# EAGLE design mixer_board_smd_full (EAGLE 9.4.0)
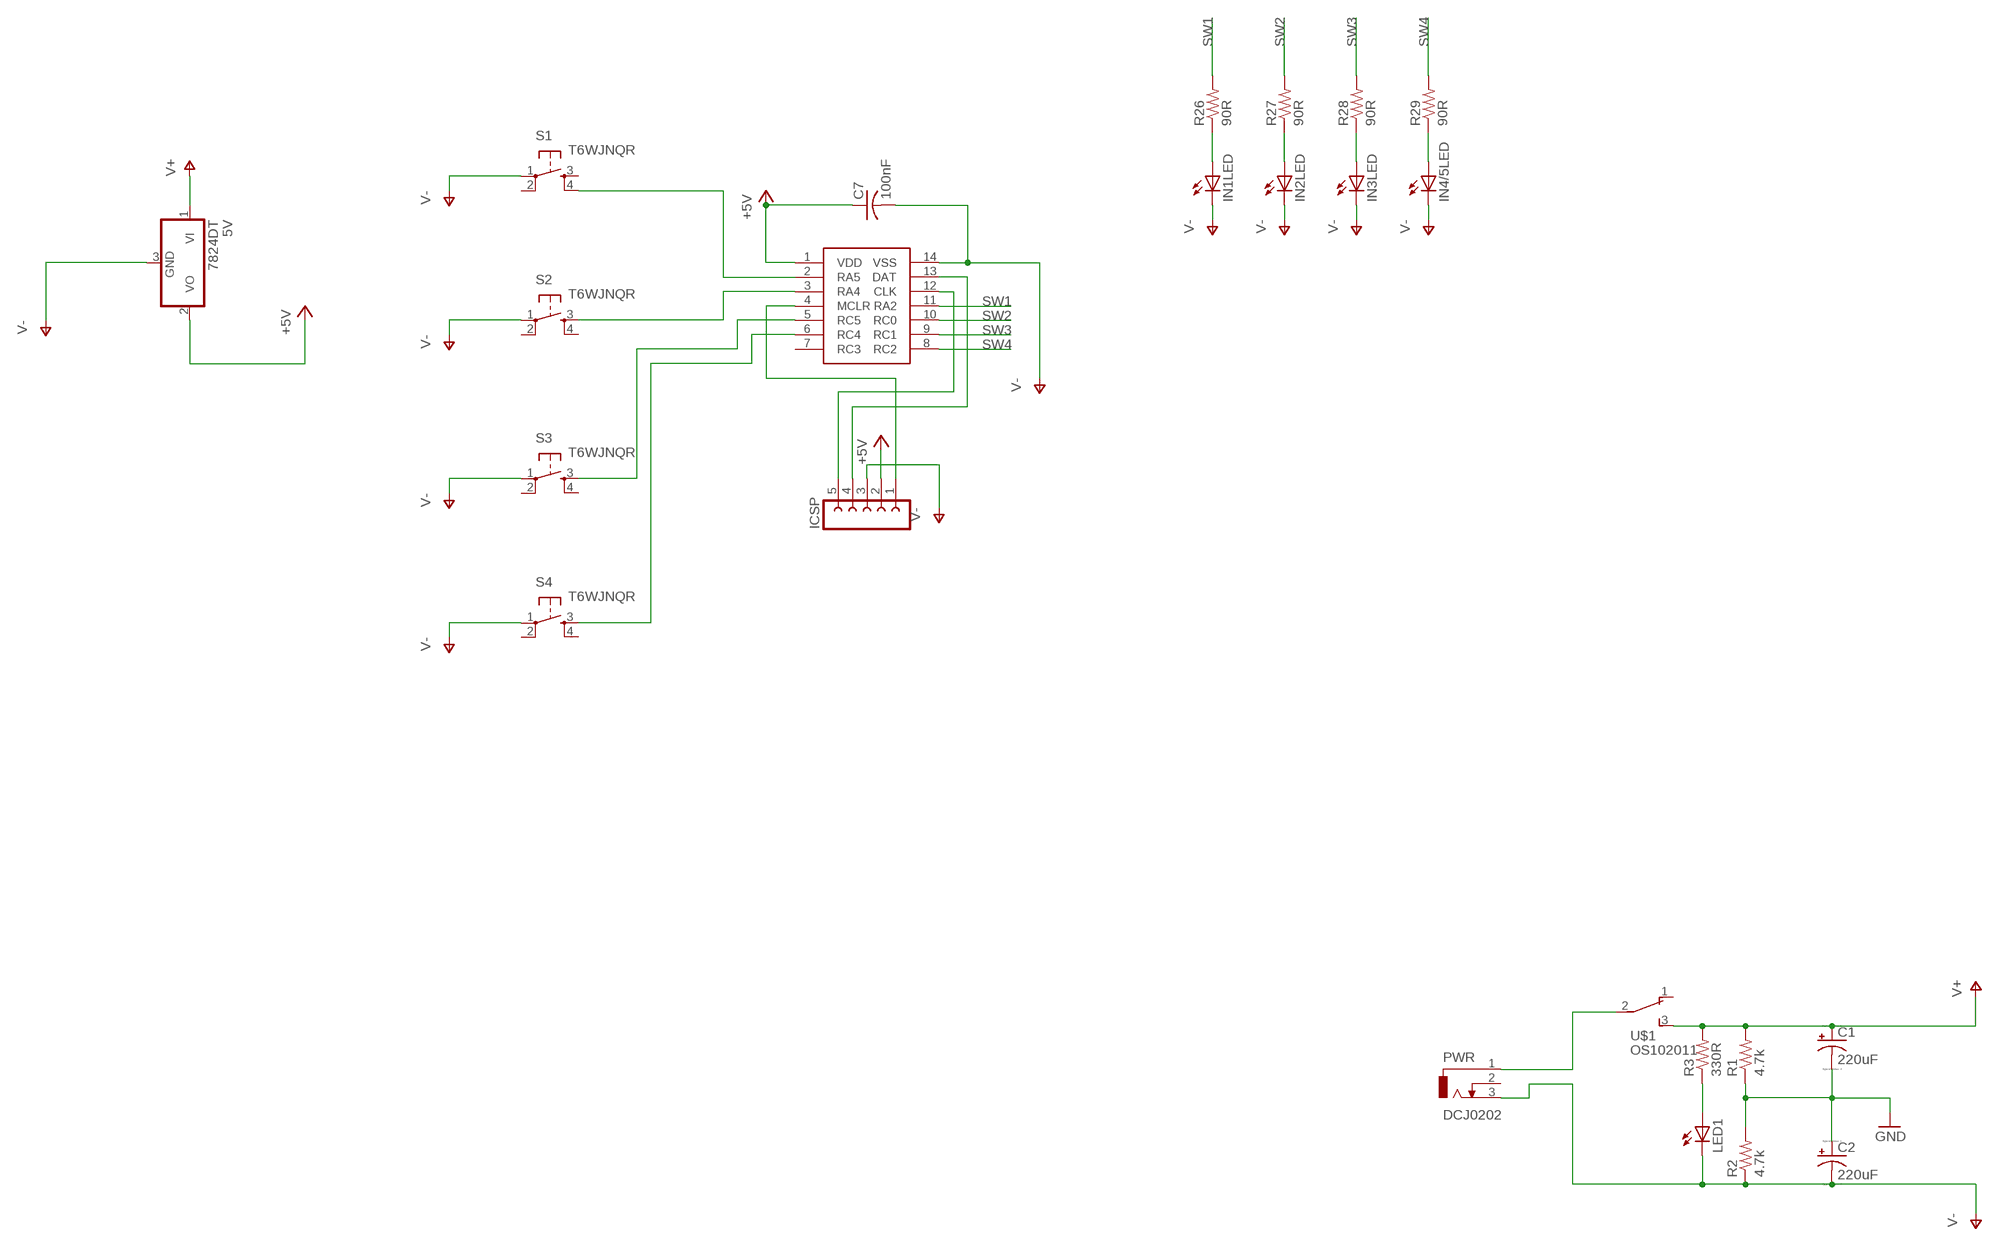
[diagram p0: schematic, sheet 1, part 1 of 2]
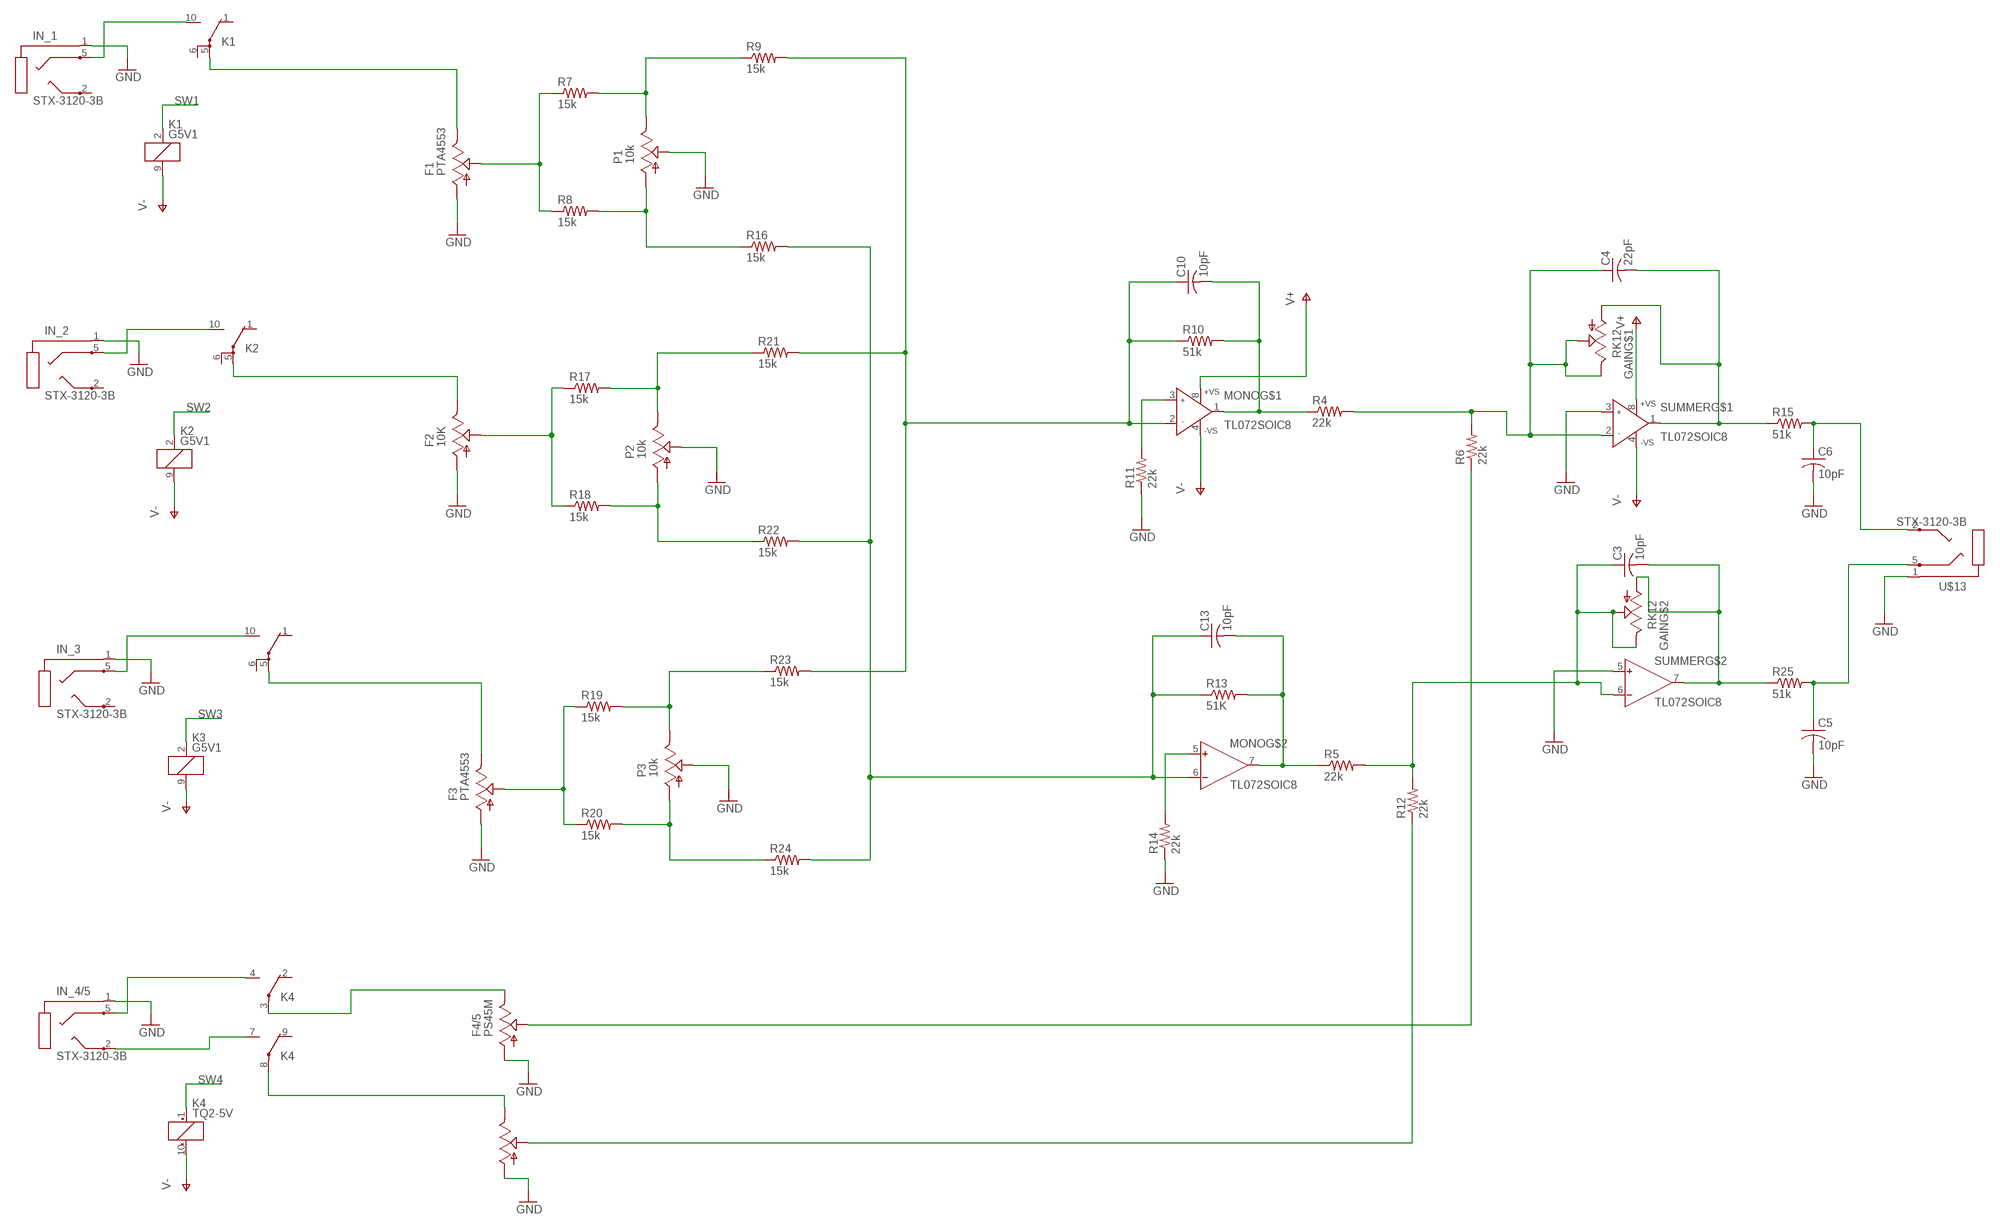
[diagram p1: schematic, sheet 1, part 2 of 2]

## Parts
5V  7824DT  [TO252]
C1  220uF  CPOL-USE1.8-4  [E1,8-4]
C2  220uF  CPOL-USE1.8-4  [E1,8-4]
C3  10pF  C-USC0805  [C0805]
C4  22pF  C-USC0805  [C0805]
C5  10pF  C-USC0805  [C0805]
C6  10pF  C-USC0805  [C0805]
C7  100nF  C-USC0805  [C0805]
C10  10pF  C-USC0805  [C0805]
C13  10pF  C-USC0805  [C0805]
F1  PTA4553  [PTA4553]
F2  10K  PTA4553  [PTA4553]
F3  PTA4553  [PTA4553]
F4/5  PS45M  [PS45M]
GAIN  RK12  [RK12]
ICSP  FE05-1  [FE05-1]
IN1LED  LEDCHIPLED_1206  [CHIPLED_1206]
IN2LED  LEDCHIPLED_1206  [CHIPLED_1206]
IN3LED  LEDCHIPLED_1206  [CHIPLED_1206]
IN4/5LED  LEDCHIPLED_1206  [CHIPLED_1206]
IN_1  STX-3120-3B  [STX-3120]
IN_2  STX-3120-3B  [STX-3120]
IN_3  STX-3120-3B  [STX-3120]
IN_4/5  STX-3120-3B  [STX-3120]
K1  G5V1  [G5V1]
K2  G5V1  [G5V1]
K3  G5V1  [G5V1]
K4  TQ2-5V  [TQ2]
LED1  LEDCHIPLED_1206  [CHIPLED_1206]
MONO  TL072SOIC8  [SOIC8]
P1  10k  PTV09A  [PTV09A]
P2  10k  PTV09A  [PTV09A]
P3  10k  PTV09A  [PTV09A]
PIC16  PIC16F18426  [SO14]
PWR  DCJ0202  [DCJ0202]
R1  4.7k  R-US_M0805  [M0805]
R2  4.7k  R-US_M0805  [M0805]
R3  330R  R-US_R0805  [R0805]
R4  22k  R-US_M0805  [M0805]
R5  22k  R-US_M0805  [M0805]
R6  22k  R-US_M0805  [M0805]
R7  15k  R-US_M0805  [M0805]
R8  15k  R-US_M0805  [M0805]
R9  15k  R-US_M0805  [M0805]
R10  51k  R-US_M0805  [M0805]
R11  22k  R-US_M0805  [M0805]
R12  22k  R-US_M0805  [M0805]
R13  51K  R-US_M0805  [M0805]
R14  22k  R-US_M0805  [M0805]
R15  51k  R-US_M0805  [M0805]
R16  15k  R-US_M0805  [M0805]
R17  15k  R-US_M0805  [M0805]
R18  15k  R-US_M0805  [M0805]
R19  15k  R-US_M0805  [M0805]
R20  15k  R-US_M0805  [M0805]
R21  15k  R-US_M0805  [M0805]
R22  15k  R-US_M0805  [M0805]
R23  15k  R-US_M0805  [M0805]
R24  15k  R-US_M0805  [M0805]
R25  51k  R-US_M0805  [M0805]
R26  90R  R-US_M0805  [M0805]
R27  90R  R-US_M0805  [M0805]
R28  90R  R-US_M0805  [M0805]
R29  90R  R-US_M0805  [M0805]
S1  T6WJNQR  [T6WJ2NGQR]
S2  T6WJNQR  [T6WJ2NGQR]
S3  T6WJNQR  [T6WJ2NGQR]
S4  T6WJNQR  [T6WJ2NGQR]
SUMMER  TL072SOIC8  [SOIC8]
U$1  OS102011  [OS102011]
U$13  STX-3120-3B  [STX-3120]

## Nets
+5V: 5V.2(VO) C7.1 ICSP.2 PIC16.1(VDD)
GND: C1.- C2.+ C5.2 C6.2 F1.1 F2.1 F3.1 F4/5.1 F4/5.1' IN_1.1 IN_2.1 IN_3.1 IN_4/5.1 P1.2 P2.2 P3.2 R1.1 R2.2 R11.1 R14.1 SUMMER.3(IN+) SUMMER.5(IN+) U$13.1
N$2: LED1.A R3.1
N$3: PIC16.2(RA5) S1.4
N$4: PIC16.3(RA4) S2.3
N$5: F4/5.3 K4.3(1:P)
N$6: F4/5.3' K4.8(2:P)
N$7: C4.2 GAIN.1 R15.1 SUMMER.1(OUT)
N$8: PIC16.5(RC5) S3.3
N$9: IN1LED.A R26.1
N$10: PIC16.6(RC4) S4.3
N$11: ICSP.1 PIC16.4(MCLR)
N$12: IN_4/5.5 K4.4(1:S)
N$13: IN_4/5.2 K4.7(2:S)
N$14: F1.2 R7.1 R8.1
N$15: F4/5.2 R6.1
N$16: P1.3 R7.2 R9.1
N$17: P1.1 R8.2 R16.1
N$18: C10.1 MONO.2(IN-) R9.2 R10.1 R21.2 R23.2
N$19: C10.2 MONO.1(OUT) R4.1 R10.2
N$20: C6.1 R15.2 U$13.2
N$21: C4.1 GAIN.2 GAIN.3 R4.2 R6.2 SUMMER.2(IN-)
N$22: MONO.3(IN+) R11.2
N$23: P2.3 R17.2 R21.1
N$24: C13.2 MONO.7(OUT) R5.1 R13.2
N$25: C5.1 R25.2 U$13.5
N$26: MONO.5(IN+) R14.2
N$27: F4/5.2' R12.1
N$28: IN2LED.A R27.1
N$29: C3.2 GAIN.1' R25.1 SUMMER.7(OUT)
N$30: C13.1 MONO.6(IN-) R13.1 R16.2 R22.2 R24.2
N$31: P2.1 R18.2 R22.1
N$32: IN3LED.A R28.1
N$33: C3.1 GAIN.2' GAIN.3' R5.2 R12.2 SUMMER.6(IN-)
N$34: IN4/5LED.A R29.1
N$35: P3.3 R19.2 R23.1
N$36: P3.1 R20.2 R24.1
N$39: F2.2 R17.1 R18.1
N$40: ICSP.4 PIC16.13(DAT)
N$41: ICSP.5 PIC16.12(CLK)
N$42: F3.2 R19.1 R20.1
N$43: IN_3.5 K3.10(2:S)
N$44: IN_2.5 K2.10(2:S)
N$45: IN_1.5 K1.10(2:S)
N$47: F2.3 K2.5(2:P)
N$48: F1.3 K1.5(2:P)
N$49: F3.3 K3.5(2:P)
N$50: PWR.1 U$1.2(P)
SW1: K1.2 PIC16.11(RA2) R26.2
SW2: K2.2 PIC16.10(RC0) R27.2
SW3: K3.2 PIC16.9(RC1) R28.2
SW4: K4.1(_:+) PIC16.8(RC2) R29.2
V+: 5V.1(VI) C1.+ MONO.8(+VS) R1.2 R3.2 SUMMER.8(+VS) U$1.3(S)
V-: 5V.3(GND) C2.- C7.2 ICSP.3 IN1LED.C IN2LED.C IN3LED.C IN4/5LED.C K1.9 K2.9 K3.9 K4.10(_:-) LED1.C MONO.4(-VS) PIC16.14(VSS) PWR.3 R2.1 S1.1 S2.1 S3.1 S4.1 SUMMER.4(-VS)
Unconnected: IN_1.2 IN_2.2 IN_3.2 K1.1(2:O) K1.6(2:P) K2.1(2:O) K2.6(2:P) K3.1(2:O) K3.6(2:P) K4.2(1:O) K4.9(2:O) PIC16.7(RC3) PWR.2 S1.2 S1.3 S2.2 S2.4 S3.2 S3.4 S4.2 S4.4 U$1.1(O)

## Library data of the parts
5V = linear:78*: Positive VOLTAGE REGULATOR Source: http://cache.national.com/ds/LM/LM78L05.pdf http://www.fairchildsemi.com/ds/LM/LM7805.pdf
C1 C2 = resistor:CPOL-US: POLARIZED CAPACITOR, American symbol
C3-C7 C10 C13 = resistor:C-US: CAPACITOR, American symbol
F1-F3 = biblib:PTA4553
F4/5 = biblib:PS45M
GAIN = biblib:RK12
ICSP = con-lsta:FE05-1: FEMALE HEADER; OC_FARNELL: unknown; OC_NEWARK: unknown
IN1LED IN2LED IN3LED IN4/5LED LED1 = led:LED: LED OSRAM: - CHIPLED LG R971, LG N971, LY N971, LG Q971, LY Q971, LO R971, LY R971 LH N974, LH R974 LS Q976, LO Q976, LY Q976 LO Q996 - Hyper CHIPLED LW Q18S LB Q993, LB Q99A, LB R99A - SideLED LS A670, LO A670, LY A670, LG A670, LP A670 LB A673, LV A673, LT A673, LW A673 LH A674 LY A675 LS A676, LA A676, LO A676, LY A676, LW A676 LS A679, LY A679, LG A679 - Hyper Micro SIDELED® LS Y876, LA Y876, LO Y876, LY Y876 LT Y87S - SmartLED LW L88C, LW L88S LB L89C, LB L89S, LG L890 LS L89K, LO L89K, LY L89K LS L896, LA L896, LO L896, LY L896 - TOPLED LS T670, LO T670, LY T670, LG T670, LP T670 LSG T670, LSP T670, LSY T670, LOP T670, LYG T670 LG T671, LOG T671, LSG T671 LB T673, LV T673, LT T673, LW T673 LH T674 LS T676, LA T676, LO T676, LY T676, LB T676, LH T676, LSB T676, LW T676 LB T67C, LV T67C, LT T67C, LS T67K, LO T67K, LY T67K, LW E67C LS E67B, LA E67B, LO E67B, LY E67B, LB E67C, LV E67C, LT E67C LW T67C LS T679, LY T679, LG T679 LS T770, LO T770, LY T770, LG T770, LP T770 LB T773, LV T773, LT T773, LW T773 LH T774 LS E675, LA E675, LY E675, LS T675 LS T776, LA T776, LO T776, LY T776, LB T776 LHGB T686 LT T68C, LB T68C - Hyper Mini TOPLED® LB M676 - Mini TOPLED Santana® LG M470 LS M47K, LO M47K, LY M47K Source: http://www.osram.convergy.de LUXEON: - LUMILED® LXK2-PW12-R00, LXK2-PW12-S00, LXK2-PW14-U00, LXK2-PW14-V00 LXK2-PM12-R00, LXK2-PM12-S00, LXK2-PM14-U00 LXK2-PE12-Q00, LXK2-PE12-R00, LXK2-PE12-S00, LXK2-PE14-T00, LXK2-PE14-U00 LXK2-PB12-K00, LXK2-PB12-L00, LXK2-PB12-M00, LXK2-PB14-N00, LXK2-PB14-P00, LXK2-PB14-Q00 LXK2-PR12-L00, LXK2-PR12-M00, LXK2-PR14-Q00, LXK2-PR14-R00 LXK2-PD12-Q00, LXK2-PD12-R00, LXK2-PD12-S00 LXK2-PH12-R00, LXK2-PH12-S00 LXK2-PL12-P00, LXK2-PL12-Q00, LXK2-PL12-R00 Source: www.luxeon.com KINGBRIGHT: KA-3528ASYC Source: www.kingbright.com
IN_1-IN_3 IN_4/5 U$13 = biblib:STX-3120-3B
K1-K3 = relay:G5V1: RELAY 1 x switch, 0.5 A/125 V AC, 1 A/24 V DC , Omron; MPN: G5V-1-DC24; OC_FARNELL: 9949593; OC_NEWARK: 36M6377
K4 = relay:TQ2?*: LOW PROFILE 2 FORM C RELAY NAiS Source: http://www.mew-europe.com/.. en_ds_61020_0001.pdf Source: http://www.mew-europe.com/.. en_ds_61020_0004.pdf; MF: AROMAT/ MATSUSHITA; MPN: TQ2-5V; OC_FARNELL: 1175716; OC_NEWARK: 64K3200
MONO SUMMER = biblib:TL072
P1-P3 = biblib:PTV09A
PIC16 = biblib:PIC16F18426
PWR = con-jack:DCJ0202: DC POWER JACK Source: DCJ0202.pdf; OC_FARNELL: unknown; OC_NEWARK: unknown
R1-R29 = resistor:R-US_: RESISTOR, American symbol
S1-S4 = biblib:T6WJNQR
U$1 = biblib:OS102011

## Board
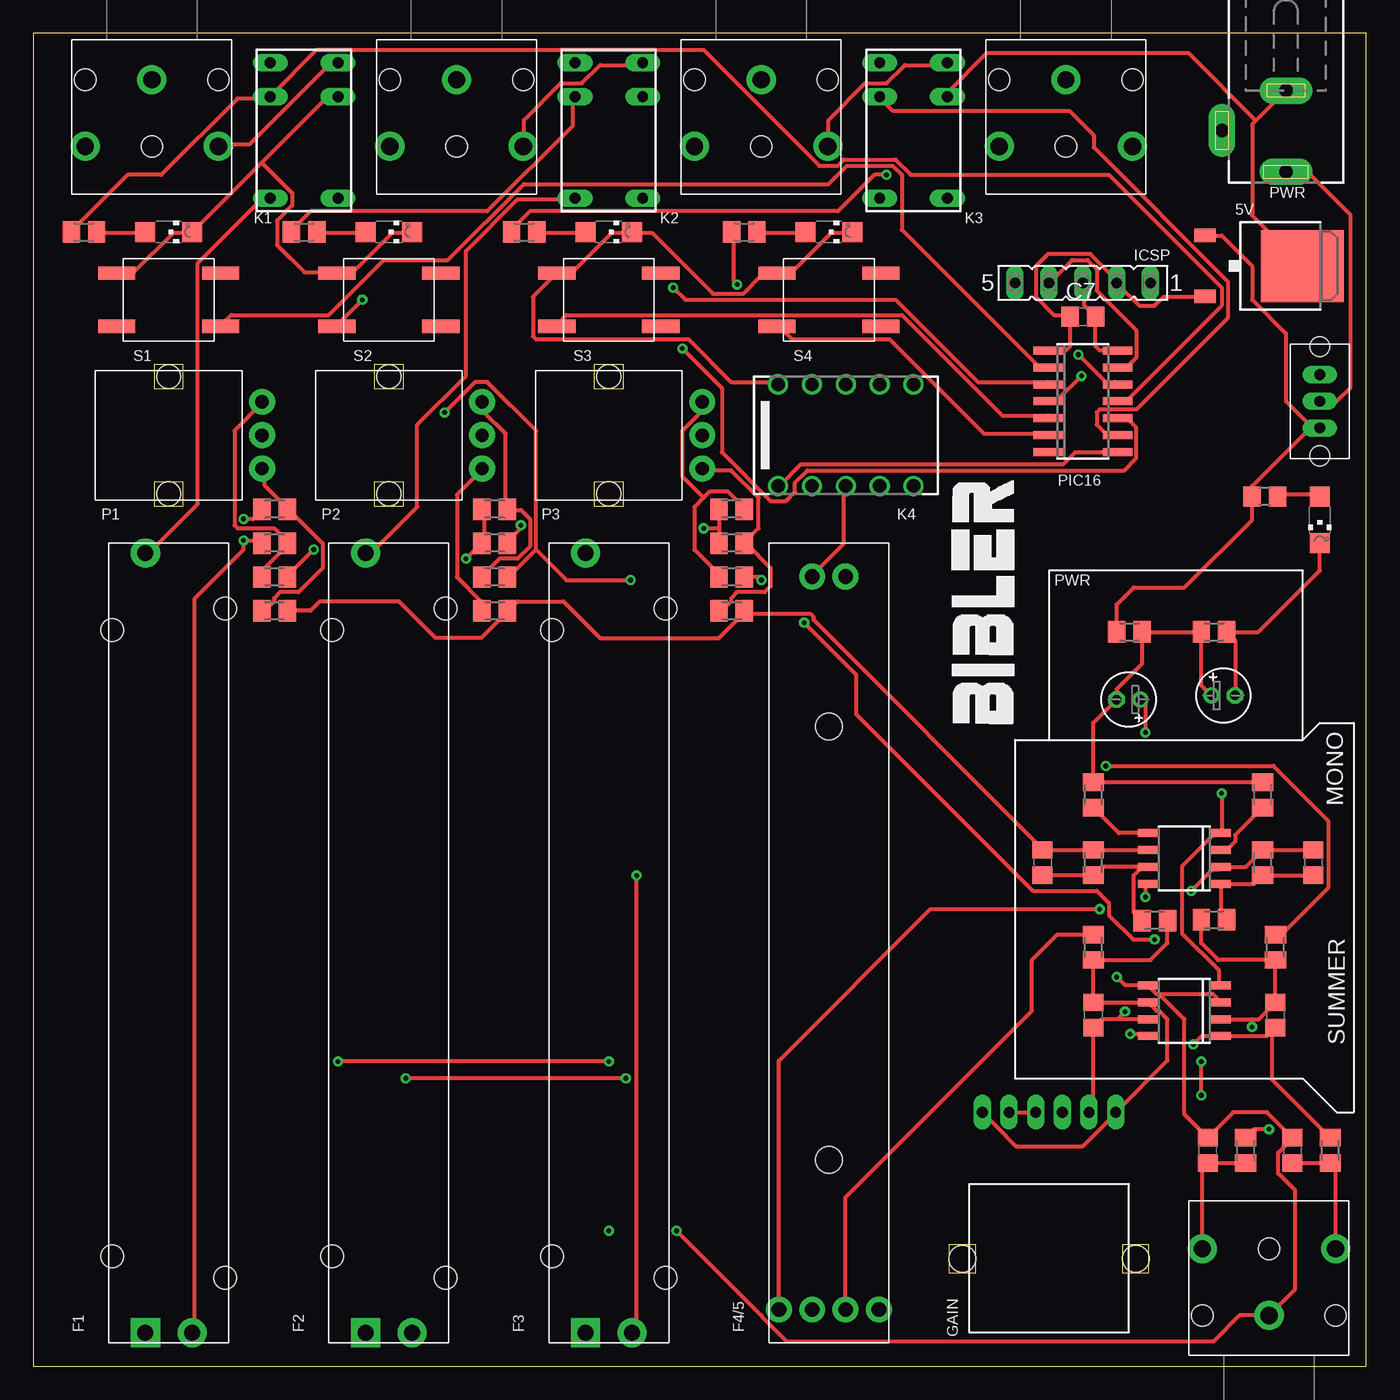
[diagram p2: board, top side]
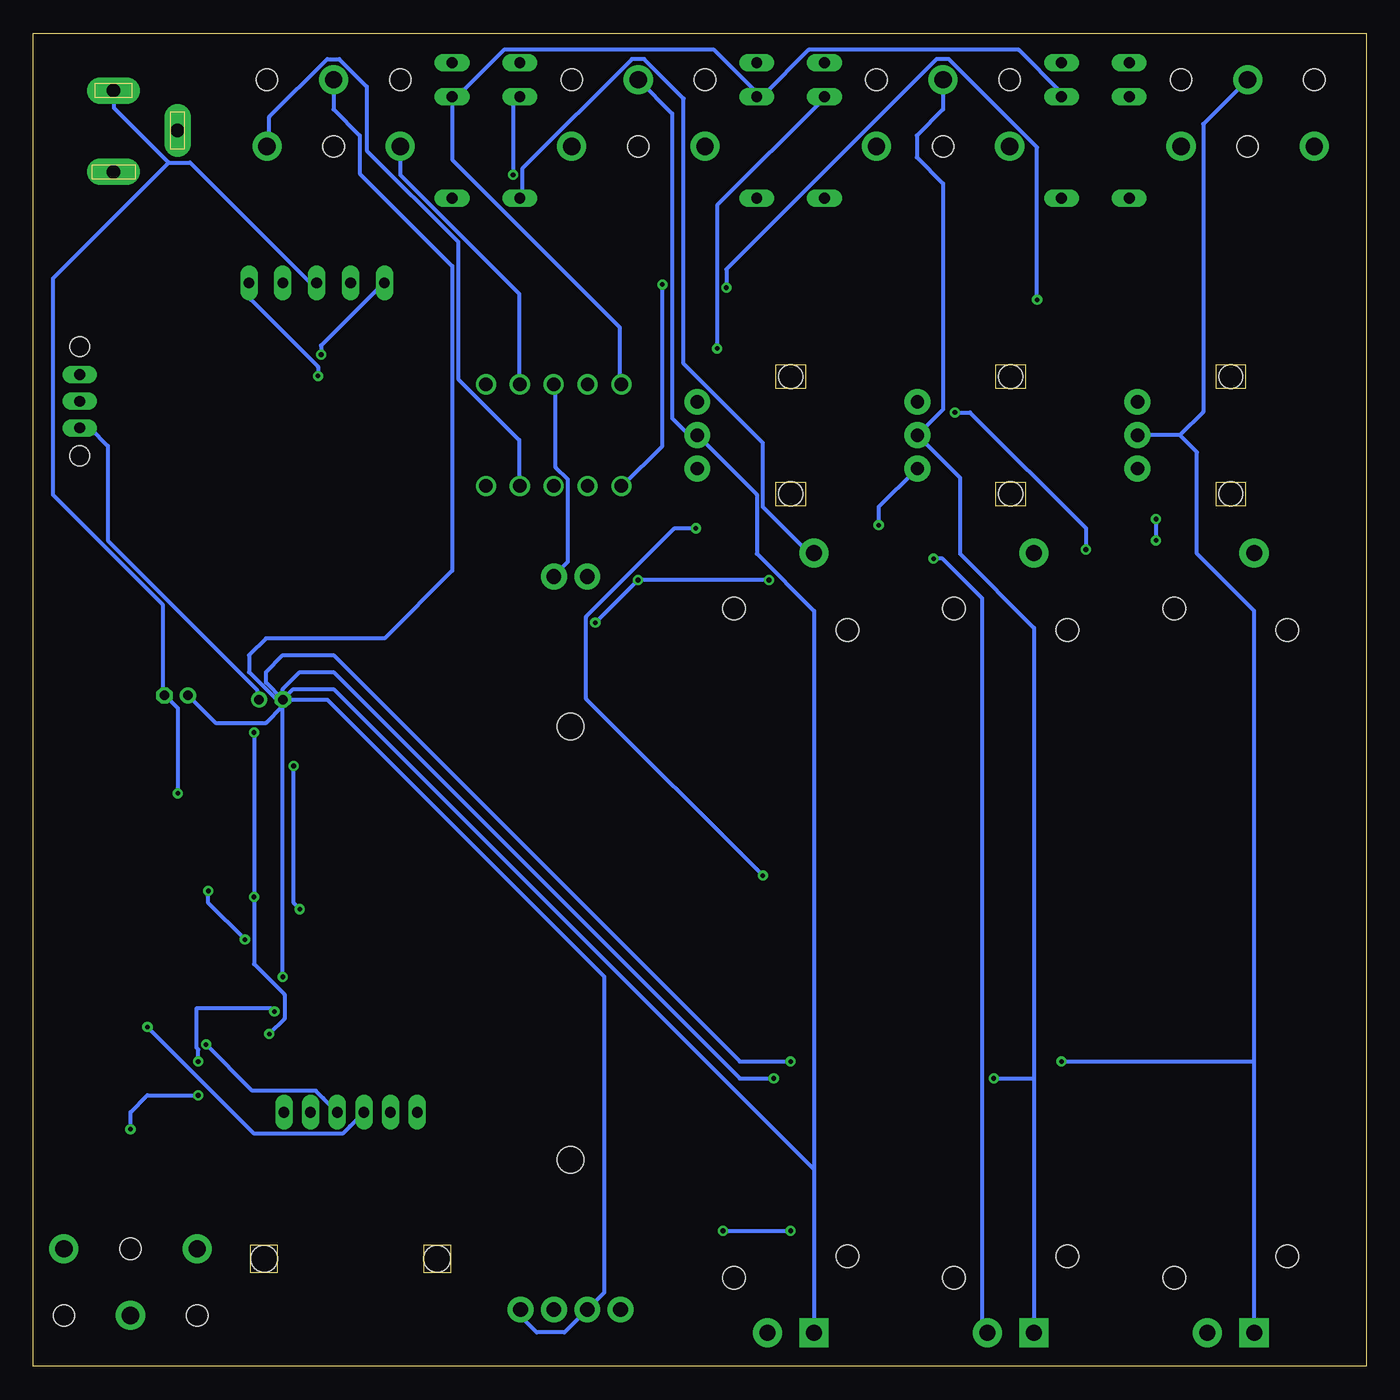
[diagram p3: board, bottom side, seen from below]

Size 100 x 100 mm. Coordinates in mm from the lower left corner, seen from the top.
Outline: 0,0 100,0 100,100 0,100 0,0
Copper layers (1*16): Top 0.035mm / dielectric 1.5mm / Bottom 0.035mm
Design rules "default *": minimum track width 12mil, minimum drill 0.35mm, track to track 6mil, track to pad 6mil, pad to pad 6mil, via to via 6mil, smd to smd 6mil, copper to edge 40mil, drill to drill 6mil, minimum pad ring 10mil, minimum via ring 8mil, stop-mask expansion 4mil, vias tented up to drill 0mil, thermal gap 10mil

### Footprints (pad centres in the part's own frame; a part is rotated, then mirrored left to right if it is on the bottom)
TO252 = smd 1 x 1.6: 1 -2.28,-4.8; 2 2.28,-4.8 | smd 5.4 x 6.2: 3 0,2.5
E1,8-4 = drill 0.711 pad 1.168: + -0.889,0 | drill 0.711 pad 1.168 octagon: - 0.889,0
C0805 = smd 1.3 x 1.5: 1 -0.95,0; 2 0.95,0
PTA4553 = drill 1.2 pad 2.184 square: 1 -29.25,1.75 | drill 1.2 pad 2.184: 2 -29.25,-1.75; 3 29.25,1.75 | hole 1.7: -23.5,4.25; 23.5,4.25; -25.1,-4.25; 25.1,-4.25
PS45M = drill 1.1 pad 1.93: 1 -27.5,1.25; 1' -27.5,-3.75; 2 -27.5,3.75; 2' -27.5,-1.25; 3 27.5,1.25; 3' 27.5,-1.25 | hole 2: -16.25,0; 16.25,0
RK12 = drill 0.8 long: 1 -1,0; 1' -3,0; 2 1,0; 2' -5,0; 3 3,0; 3' 5,0 | hole 2: -6.5,11; 6.5,11
FE05-1 = drill 0.813 long: 1 -5.08,0; 2 -2.54,0; 3 0,0; 4 2.54,0; 5 5.08,0
CHIPLED_1206 = smd 1.5 x 1.5: A 0,-1.75; C 0,1.75
STX-3120 = drill 1.3 pad 2.184: 1 0,0; 2 5,-5; 5 5,5 | hole 1.6: 0,5; 0,-5; 5,0
G5V1 = drill 0.813 long: 1 -5.08,-2.54; 2 -2.54,-2.54; 5 5.08,-2.54; 6 5.08,2.54; 9 -2.54,2.54; 10 -5.08,2.54
TQ2 = drill 1: 1 -5.08,-3.81; 2 -2.54,-3.81; 3 0,-3.81; 4 2.54,-3.81; 5 5.08,-3.81; 6 5.08,3.81; 7 2.54,3.81; 8 0,3.81; 9 -2.54,3.81; 10 -5.08,3.81
SOIC8 = smd 0.6 x 1.5: 1 -1.905,-2.75; 2 -0.635,-2.75; 3 0.635,-2.75; 4 1.905,-2.75; 5 1.905,2.75; 6 0.635,2.75; 7 -0.635,2.75; 8 -1.905,2.75
PTV09A = drill 1 pad 1.93: 1 -2.5,-7; 2 0,-7; 3 2.5,-7 | hole 1.8: -4.4,0; 4.4,0
SO14 = smd 0.6 x 2.2: 1 -3.81,-2.6; 2 -2.54,-2.6; 3 -1.27,-2.6; 4 0,-2.6; 5 1.27,-2.6; 6 2.54,-2.6; 7 3.81,-2.6; 8 3.81,2.6; 9 2.54,2.6; 10 1.27,2.6; 11 0,2.6; 12 -1.27,2.6; 13 -2.54,2.6; 14 -3.81,2.6
DCJ0202 = drill 1 pad 2 long: 1 0,3.1; 2 4.8,0; 3 0,-3
M0805 = smd 1.3 x 1.6: 1 -0.95,0; 2 0.95,0
R0805 = smd 1.3 x 1.5: 1 -0.95,0; 2 0.95,0
T6WJ2NGQR = smd 2.8 x 1: 1 -3.9,2; 2 3.9,2; 3 -3.9,-2; 4 3.9,-2
OS102011 = drill 0.8 long: 1 -2,0; 2 0,0; 3 2,0 | hole 1.5: -4.1,0; 4.1,0

### Placement (x,y rotation side)
5V  92.71,82.55 270 top
C1  82.17,50.01 180 top
C2  89.28,50.32 0 top
C3  79.53,26.35 270 top
C4  93.19,26.35 270 top
C5  88.11,16.2 90 top
C6  94.46,16.2 90 top
C7  78.74,78.74 0 top
C10  96.04,37.78 270 top
C13  75.72,37.78 270 top
F1  10.16,31.75 90 top
F2  26.67,31.75 90 top
F3  43.18,31.75 90 top
F4/5  59.69,31.75 90 top
GAIN  76.2,19.05 180 top
ICSP  78.74,81.28 180 top
IN1LED  10.16,85.09 270 top
IN2LED  26.67,85.09 270 top
IN3LED  43.18,85.09 270 top
IN4/5LED  59.69,85.09 270 top
IN_1  8.89,96.52 270 top
IN_2  31.75,96.52 270 top
IN_3  54.61,96.52 270 top
IN_4/5  77.47,96.52 270 top
K1  20.32,92.71 270 top
K2  43.18,92.71 270 top
K3  66.04,92.71 270 top
K4  60.96,69.85 0 top
LED1  96.52,63.5 180 top
MONO  86.36,38.1 90 top
P1  10.16,69.85 90 top
P2  26.67,69.85 90 top
P3  43.18,69.85 90 top
PIC16  78.74,72.39 270 top
PWR  93.98,92.71 180 top
R1  82.23,55.09 180 top
R2  88.58,55.09 180 top
R3  92.39,65.25 180 top
R4  88.58,33.5 180 top
R5  84.14,33.43 0 top
R6  93.19,31.43 270 top
R7  18.1,61.75 0 top
R8  18.1,64.29 0 top
R9  18.1,59.21 0 top
R10  92.23,37.78 270 top
R11  92.23,42.86 270 top
R12  79.53,31.43 270 top
R13  79.53,37.78 270 top
R14  79.53,42.86 270 top
R15  97.31,16.19 270 top
R16  18.1,56.67 0 top
R17  34.61,64.29 0 top
R18  34.61,61.75 0 top
R19  52.39,64.29 0 top
R20  52.39,61.75 0 top
R21  34.61,59.21 0 top
R22  34.61,56.67 0 top
R23  52.39,59.21 0 top
R24  52.39,56.67 0 top
R25  90.96,16.19 270 top
R26  3.81,85.09 180 top
R27  20.32,85.09 180 top
R28  36.83,85.09 180 top
R29  53.34,85.09 180 top
S1  10.16,80.01 0 top
S2  26.67,80.01 0 top
S3  43.18,80.01 0 top
S4  59.69,80.01 0 top
SUMMER  86.36,26.67 90 top
U$1  96.52,72.39 270 top
U$13  92.71,3.81 90 top

### Tracks (layer width: path | path; a pad name or v marks a point on that pad's centre or on a via)
+5V
  Top 0.305: PIC16.1 77.47,76.2 77.79,76.52 C7.1 77.72,78.87 76.58,78.87 75.21,80.24 75.21,82.53 76.12,83.44 79.32,83.44 81.38,81.38 ICSP.2 81.38,81.15 82.98,79.55 84.12,79.55 84.81,80.24 87.78,80.24 5V.2
GND  (via drill 0.35)
  Top 0.305: v44.45,21.59 v27.94,21.59 | v43.18,22.86 v22.86,22.86 | C2.+ 87.63,51.08 R2.2 R1.1 83.18,52.7 81.28,50.8 C1.- 79.53,48.26 R14.1 R11.1 | 84.25,27.94 SUMMER.5 81.92,28.57 v81.28,29.21 | SUMMER.3 88.47,27.94 84.25,27.94 | 84.25,27.94 84.28,27.91 84.49,27.91 86.36,26.04 86.36,18.89 C5.2 90.02,19.05 92.56,19.05 C6.2 94.46,17.08 93.41,16.02 93.41,14.47 94.68,13.2 94.68,5.78 U$13.1 90.49,3.81 88.53,1.84 56.55,1.84 54.67,3.72 54.67,3.75 v48.26,10.16
  Bottom 0.305: F1.1 8.41,22.86 | 8.41,22.86 8.41,56.67 12.7,60.96 12.7,68.58 13.97,69.85 | 13.97,69.85 P1.2 | IN_1.1 12.23,93.18 12.23,71.59 13.97,69.85 | IN_2.1 31.75,94.3 33.72,92.33 33.72,90.7 31.75,88.74 31.75,71.77 P2.2 30.48,66.66 30.48,60.96 24.92,55.4 24.92,21.59 | 24.92,21.59 F2.1 | IN_3.1 52.07,93.98 52.07,71.12 50.8,69.85 P3.2 45.72,65.39 45.72,60.96 41.43,56.67 41.43,14.76 | 41.43,14.76 F3.1 | C1.- 77.95,50.01 57.15,29.21 57.15,5.54 F4/5.1 60.15,2.54 62.23,2.54 63.44,3.75 F4/5.1' | C1.- 80.49,50.8 77.47,50.8 41.43,14.76 | C1.- 81.28,50.8 80.01,52.07 77.47,52.07 46.99,21.59 v44.45,21.59 | v27.94,21.59 24.92,21.59 | C1.- 82.55,51.28 82.55,52.07 81.28,53.34 77.47,53.34 46.99,22.86 v43.18,22.86 | v22.86,22.86 8.41,22.86 | IN_4/5.1 77.47,94.3 75.5,92.33 75.5,89.47 68.58,82.55 68.58,59.69 73.66,54.61 82.55,54.61 83.82,53.34 83.82,52.07 81.76,50.01 C1.- | C2.+ 86.33,48.26 82.55,48.26 81.28,49.53 C1.- | v81.28,29.21 C1.- | v48.26,10.16 v43.18,10.16
N$2
  Top 0.305: R3.1 93.5,65.38 96.47,65.38 LED1.A
N$3
  Top 0.305: PIC16.2 76.12,74.98 75.44,74.98 65.15,85.27 65.15,89.38 64.47,90.07 61.04,90.07 59.66,88.7 36.8,88.7 31.09,82.98 26.29,82.98 22.17,78.87 14.86,78.87 14.17,78.18 S1.4
N$4  (via drill 0.35)
  Top 0.305: v48.01,80.92 48.92,80.01 64.69,80.01 70.87,73.84 76.12,73.84 PIC16.3 | v24.69,80.01 22.86,78.18 S2.3
  Bottom 0.305: v48.01,80.92 48.01,82.3 32.23,98.07 31.32,98.07 24.69,91.44 v24.69,80.01
N$5
  Top 0.305: K4.3 60.81,65.84 60.81,61.72 58.52,59.44 F4/5.3
N$6
  Bottom 0.305: K4.8 60.81,73.61 60.81,67.44 59.89,66.52 59.89,60.35 60.81,59.44 F4/5.3'
N$7  (via drill 0.35)
  Top 0.305: 92.95,25.16 92.56,24.77 SUMMER.1 87.68,24.77 v87.04,24.13 | 92.95,25.16 C4.2 | R15.1 92.95,21.5 92.95,25.16
  Bottom 0.305: GAIN.1 78.24,20.09 78.24,20.1 78.8,20.66 83.58,20.66 v87.04,24.13
N$8
  Top 0.305: PIC16.5 76.12,71.32 72.69,71.32 65.15,78.87 40.01,78.87 39.32,78.18 S3.3
N$9
  Top 0.305: IN1LED.A 8.23,85.04 4.8,85.04 R26.1
N$10
  Top 0.305: PIC16.6 76.12,69.95 71.32,69.95 64.24,77.04 56.92,77.04 56.01,77.95 S4.3
N$11  (via drill 0.35)
  Top 0.305: v78.64,74.3 76.81,72.47 76.35,72.47 PIC16.4
  Bottom 0.305: v78.64,74.3 78.64,74.98 83.67,80.01 83.67,81.15 ICSP.1
N$12
  Bottom 0.305: K4.4 63.55,66.06 63.55,69.49 68.12,74.07 68.12,84.35 74.98,91.21 74.98,96.01 77.04,98.07 77.95,98.07 82.3,93.73 82.3,91.67 IN_4/5.5
N$13
  Bottom 0.305: K4.7 63.55,73.84 63.55,80.47 72.47,89.38 72.47,91.44 IN_4/5.2
N$14  (via drill 0.35)
  Top 0.305: v15.77,63.55 16.46,63.55 17.14,64.24 R8.1 | R7.1 17.14,61.95 v15.77,61.95 15.77,61.27 12.12,57.61 12.12,2.52 F1.2
  Bottom 0.305: v15.77,63.55 v15.77,61.95
N$15  (via drill 0.35)
  Top 0.305: F4/5.2 55.94,22.92 67.31,34.29 v80.01,34.29 | v80.47,45.03 93.04,45.03 97.16,40.92 97.16,35.89 93.73,32.46 93.27,32.46 R6.1
  Bottom 0.305: v80.47,45.03 80.47,34.75 v80.01,34.29
N$16
  Top 0.305: R9.1 17.37,59.44 17.37,59.89 19.2,61.72 R7.2 18.97,61.95 18.06,62.87 15.32,62.87 15.09,63.09 15.09,70.18 17.14,72.24 P1.3
N$17
  Top 0.305: R16.1 17.37,56.69 18.06,57.38 18.06,57.61 18.52,58.06 19.89,58.06 21.72,59.89 21.72,61.72 19.2,64.24 R8.2 18.97,64.47 17.37,66.06 17.37,67.21 P1.1
N$18  (via drill 0.35)
  Top 0.305: C10.1 R10.1 90.97,37.47 MONO.2 88.92,37.26 88.47,37.26 v86.87,35.66 | v21.03,61.27 19.2,59.44 R9.2 | v30.86,71.55 33.15,73.84 34.06,73.84 37.72,70.18 37.72,61.27 | 37.72,61.27 35.66,59.21 R21.2 | v54.63,58.98 54.41,59.21 53.49,59.21 R23.2 | v44.81,58.98 40.01,58.98 37.72,61.27 | v84.12,32 82.53,32 80.7,33.83 80.7,34.75 79.78,35.66 74.98,35.66 61.72,48.92 61.72,51.89 v57.84,55.78
  Bottom 0.305: v21.03,61.27 21.03,62.87 29.72,71.55 v30.86,71.55 | v44.81,58.98 v54.63,58.98 v57.84,55.78 | v86.87,35.66 86.87,34.75 v84.12,32
N$19
  Top 0.305: R4.1 89.11,33.92 MONO.1 91.59,36.2 R10.2 C10.2
N$20
  Top 0.305: U$13.2 97.71,14.84 R15.2 C6.1
N$21  (via drill 0.35)
  Top 0.305: SUMMER.2 91.44,26.04 | 91.44,26.04 91.92,26.04 C4.1 R6.2 88.9,30.48 87.63,31.75 R4.2 | GAIN.3 GAIN.2 | v91.44,25.45 91.44,26.04
  Bottom 0.305: GAIN.2 76.24,18.01 76.24,18 76.8,17.44 83.43,17.44 v91.44,25.45
N$22
  Top 0.305: R11.2 90.17,39.85 90.17,39.37 89.53,38.73 MONO.3
N$23
  Top 0.305: R21.1 33.83,59.44 34.98,60.58 36.35,60.58 37.26,61.49 37.26,63.55 36.58,64.24 35.66,64.24 R17.2 35.43,64.47 35.43,69.95 33.83,71.55 33.83,72.24 P2.3
N$24
  Top 0.305: R5.1 82.55,34.07 82.55,36.83 83.19,37.47 MONO.7 80.17,37.47 R13.2 C13.2
N$25
  Top 0.305: U$13.5 87.71,14.85 C5.1 R25.2
N$26
  Top 0.305: MONO.5 81.44,40.01 R14.2
N$27
  Top 0.305: F4/5.2' 60.94,12.68 74.93,26.67 74.93,30.48 76.83,32.38 R12.1
N$28
  Top 0.305: IN2LED.A 24.92,85.04 21.49,85.04 R27.1
N$29  (via drill 0.35)
  Top 0.305: SUMMER.7 81.34,26.04 | 81.34,26.04 80.17,26.04 C3.2 79.53,19.38 GAIN.1' | v92.71,17.78 91.6,17.78 R25.1 | v87.63,20.32 v87.63,22.86 | v81.92,26.61 81.34,26.04
  Bottom 0.305: v92.71,17.78 92.71,19.05 91.44,20.32 v87.63,20.32 | v87.63,22.86 87.63,23.75 87.73,23.85 87.73,26.87 82.17,26.87 v81.92,26.61
N$30
  Top 0.305: MONO.6 R13.1 C13.1 75.67,38.86 58.52,56.01 58.52,56.24 58.29,56.46 53.49,56.46 R24.2 53.26,56.46 51.44,54.63 42.52,54.63 39.78,57.38 36.35,57.38 35.66,56.69 R22.2 35.43,56.46 33.6,54.63 30.18,54.63 27.43,57.38 21.49,57.38 20.8,56.69 19.2,56.69 R16.2
N$31  (via drill 0.35)
  Top 0.305: R22.1 33.6,56.69 33.6,57.38 31.77,59.21 31.77,65.38 33.6,67.21 P2.1 | v36.58,63.09 36.58,62.87 35.66,61.95 R18.2
  Bottom 0.305: v36.58,63.09 36.58,64.47 33.83,67.21 P2.1
N$32
  Top 0.305: IN3LED.A 41.38,85.04 37.95,85.04 R28.1
N$33
  Top 0.305: R5.2 85.09,31.75 83.82,30.48 R12.2 C3.1 SUMMER.6 84.28,26.64 84.49,26.64 85.09,26.04 85.09,22.94 81.24,19.09 | GAIN.2' 81.24,19.09 | GAIN.3' 72.24,18.01 72.24,18 73.73,16.51 78.74,16.51 81.24,19.01 81.24,19.09
N$34
  Top 0.305: IN4/5LED.A 57.84,85.04 54.41,85.04 R29.1
N$35
  Top 0.305: 50.29,65.15 50.75,65.61 52.12,65.61 53.26,64.47 R19.2 | 50.29,65.15 49.61,64.47 49.61,61.27 51.44,59.44 R23.1 | 50.29,65.15 48.69,66.75 48.69,70.18 50.06,71.55 50.06,72.24 P3.3
N$36
  Top 0.305: R24.1 51.66,56.69 52.35,57.38 52.35,57.61 52.81,58.06 54.86,58.06 55.32,58.52 55.32,59.89 53.49,61.72 R20.2 53.49,61.95 54.41,62.87 54.41,65.15 52.35,67.21 50.29,67.21 P3.1
N$39  (via drill 0.35)
  Top 0.305: R17.1 33.83,64.24 33.83,61.95 R18.1 33.6,61.72 v32.46,60.58
  Bottom 0.305: v32.46,60.58 31.77,60.58 28.8,57.61 28.8,2.74 28.57,2.52 F2.2
N$40
  Top 0.305: PIC16.13 81.38,74.98 82.07,74.98 82.75,75.67 82.75,77.72 79.78,80.7 79.78,82.3 79.1,82.98 77.95,82.98 76.35,81.38 ICSP.4
N$41  (via drill 0.35)
  Top 0.305: v78.41,75.89 80.47,73.84 81.15,73.84 PIC16.12
  Bottom 0.305: v78.41,75.89 78.41,76.58 73.84,81.15 ICSP.5
N$42  (via drill 0.35)
  Top 0.305: 51.44,62.87 51.44,64.24 R19.1 | 51.44,62.87 51.44,61.95 R20.1 | v50.29,62.87 51.44,62.87 | v45.26,36.8 45.26,2.74 45.03,2.52 F3.2
  Bottom 0.305: v50.29,62.87 51.89,62.87 58.52,56.24 58.52,50.06 v45.26,36.8
N$43
  Top 0.305: K3.10 68.58,97.61 65.38,97.61 64.01,96.24 62.41,96.24 59.66,93.5 59.66,91.67 IN_3.5
N$44
  Top 0.305: K2.10 45.72,97.61 42.52,97.61 41.15,96.24 39.55,96.24 36.8,93.5 36.8,91.67 IN_2.5
N$45
  Top 0.305: K1.10 22.86,97.61 22.17,97.61 16.23,91.67 13.95,91.67 IN_1.5
N$47
  Top 0.305: K2.5 40.46,87.55 36.35,87.55 32.46,83.67 32.46,74.3 28.8,70.64 28.8,64.47 25.15,60.81 F2.3
N$48
  Top 0.305: K1.5 17.6,87.55 17.14,87.55 12.34,82.75 12.34,64.69 8.46,60.81 F1.3
N$49
  Bottom 0.305: K3.5 63.32,87.78 63.32,89.84 55.09,98.07 54.18,98.07 51.21,95.1 51.21,75.21 45.26,69.27 45.26,64.47 41.6,60.81 F3.3
N$50
  Top 0.305: U$1.2 97.79,72.39 98.83,73.43 98.83,86.36 95.58,89.61 PWR.1
SW1
  Top 0.305: R26.2 2.97,85.27 7.09,89.38 9.6,89.38 15.32,95.1 17.6,95.1 K1.2 17.83,95.33 21.26,98.75 50.29,98.75 58.98,90.07 60.35,90.07 60.81,90.53 64.69,90.53 65.84,89.38 80.7,89.38 89.15,80.92 89.15,79.55 82.07,72.47 81.38,72.47 PIC16.11
SW2  (via drill 0.35)
  Top 0.305: R27.2 19.43,85.27 20.8,86.64 34.06,86.64 40.46,93.04 40.46,95.1 K2.2 | v48.69,76.35 51.66,73.38 51.66,68.58 55.32,64.92 56.46,64.92 57.15,65.61 57.15,66.29 58.06,67.21 81.84,67.21 82.75,68.12 82.75,70.41 82.07,71.09 81.38,71.09 PIC16.10
  Bottom 0.305: v48.69,76.35 48.69,87.1 40.69,95.1 K2.2
SW3  (via drill 0.35)
  Top 0.305: v64.01,89.38 63.09,89.38 60.35,86.64 37.26,86.64 35.89,85.27 R28.2 | PIC16.9 81.15,69.95 80.47,69.95 79.78,70.64 79.78,71.55 80.01,71.78 82.75,71.78 89.61,78.64 89.61,81.38 79.55,91.44 79.55,92.35 77.72,94.18 64.47,94.18 63.55,95.1 K3.2
  Bottom 0.305: v64.01,89.38 64.01,94.64 63.55,95.1 K3.2
SW4  (via drill 0.35)
  Top 0.305: v52.81,81.15 52.58,81.38 52.58,85.04 R29.2 | PIC16.8 78.18,68.58 77.27,67.67 57.61,67.67 56.01,66.06 K4.1
  Bottom 0.305: v52.81,81.15 52.81,69.04 55.78,66.06 K4.1
V+  (via drill 0.35)
  Top 0.305: 5V.1 89.16,84.83 91.44,82.55 91.44,80.01 93.98,77.47 93.98,72.39 95.98,70.39 U$1.3 95.79,70.39 91.44,66.04 R3.2 91.44,63.5 86.36,58.42 82.55,58.42 81.28,57.15 R1.2 | v82.3,24.92 83.44,24.92 SUMMER.8 | v83.44,35.2 83.44,36.12 MONO.8 | v83.44,47.55 83.44,49.61 83.21,49.84 C1.+
  Bottom 0.305: v82.3,24.92 81.15,26.06 81.15,27.89 83.44,30.18 v83.44,35.2 v83.44,47.55 | C1.+ 83.21,50.06 83.21,50.75 94.41,61.95 94.41,69.04 95.78,70.41 96.47,70.41 U$1.3
V-  (via drill 0.35)
  Top 0.305: PWR.3 91.72,93.45 | 91.72,93.45 91.44,93.17 91.44,86.32 5V.3 | PIC16.14 80.01,76.2 79.69,76.52 C7.2 79.55,78.87 78.87,79.55 78.87,81.15 ICSP.3 | LED1.C 96.52,59.69 91.92,55.09 R2.1 90.17,54.45 C2.- | SUMMER.4 88.92,28.57 88.92,29.72 86.18,32.46 86.18,37.49 88.7,40.01 MONO.4 89.15,40.01 v89.15,42.98 | IN4/5LED.C 61.27,85.04 59.89,85.04 56.92,82.07 56.01,82.07 S4.1 55.78,81.84 54.63,81.84 53.26,80.47 50.98,80.47 46.41,85.04 45.03,85.04 IN3LED.C 44.81,85.04 43.43,85.04 40.46,82.07 39.32,82.07 S3.1 39.09,81.84 37.49,80.24 37.49,77.27 37.72,77.04 49.15,77.04 52.35,73.84 55.78,73.84 K4.10 | IN2LED.C 28.35,85.04 26.98,85.04 24,82.07 22.86,82.07 S2.1 22.63,82.07 20.34,82.07 18.29,84.12 18.29,85.95 19.43,87.1 19.43,88.01 17.14,90.3 | S1.1 6.4,82.07 7.54,82.07 10.52,85.04 11.89,85.04 IN1LED.C 12.12,85.27 17.14,90.3 | 17.14,90.3 21.95,95.1 22.86,95.1 K1.9 | 91.72,93.45 86.64,98.53 71.55,98.53 68.58,95.56 K3.9
  Bottom 0.305: v89.15,42.98 89.15,49.38 90.07,50.29 C2.- 90.3,50.52 90.3,57.15 98.53,65.38 98.53,81.61 89.84,90.3 | 89.84,90.3 88.24,90.3 79.32,81.38 78.87,81.38 ICSP.3 | 89.84,90.3 93.95,94.41 93.95,95.56 PWR.3 | 45.49,95.33 45.26,95.33 41.83,98.75 26.06,98.75 22.86,95.56 K1.9 | 45.49,95.33 45.72,95.33 K2.9 45.49,95.33 | 45.49,95.33 48.92,98.75 64.69,98.75 68.12,95.33 68.58,95.33 K3.9 68.58,90.53 56.01,77.95 56.01,73.84 K4.10

### Text on the board
tNames: PWR